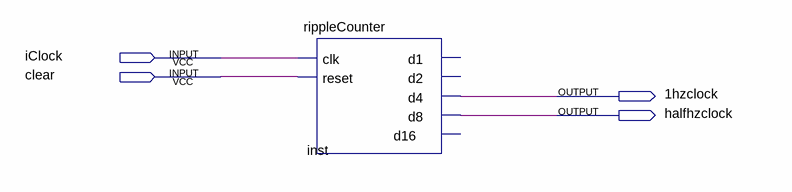
[diagram p0: schematic sheet]
// Quartus schematic clockDiv.bdf as structural Verilog: 1 symbols, 4 pins
module clockDiv (
  input  iClock,
  input  clear,
  output \1hzclock ,
  output halfhzclock
);

  rippleCounter inst (.clk(iClock), .reset(clear), .d4(\1hzclock ), .d8(halfhzclock));  // open: d1, d2, d16
endmodule
